# EAGLE design obcamera (EAGLE 9.6.2)
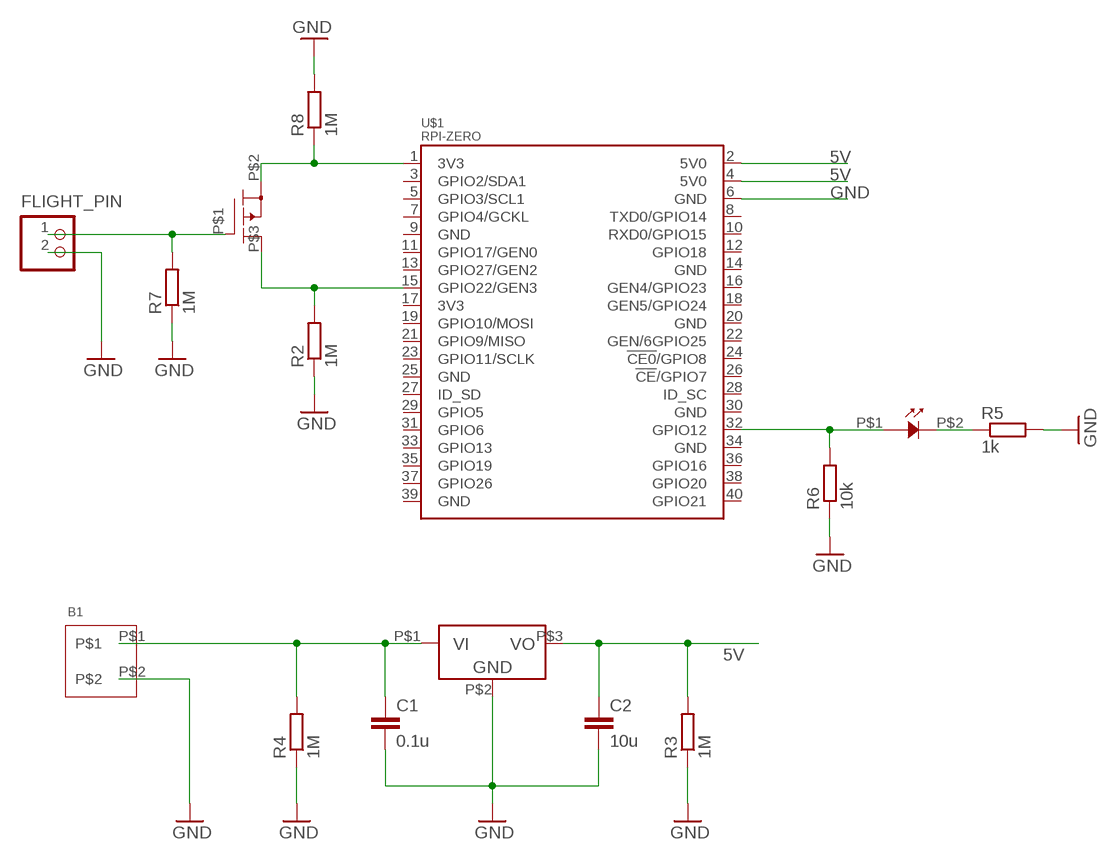
[diagram p0: schematic, sheet 1]

## Parts
B1  9V_BATTERY_HOLDER  [9V_BATTERY_HOLDER]
C1  0.1u  C-EUC2012  [C2012]
C2  10u  C-EUC2012  [C2012]
D1  SML-E1X  [SML-E1X]
FLIGHT_PIN  B2B-XH-A  [B2B-XH-A]
IC1  NJM2391  [TO252]
IC2  TJ8S06M3L  [TO252]
R2  1M  R-EU_M2012  [M2012]
R3  1M  R-EU_M2012  [M2012]
R4  1M  R-EU_M2012  [M2012]
R5  1k  R-EU_M2012  [M2012]
R6  10k  R-EU_M2012  [M2012]
R7  1M  R-EU_M2012  [M2012]
R8  1M  R-EU_M2012  [M2012]
U$1  RPI-ZERO  [RASP_PI_ZERO_BOARD_FULL]

## Nets
3V3@1: IC2.P$2 R8.1 U$1.1(3V3)
5V [supply]: C2.1 IC1.P$3 R3.2 U$1.2(5V0) U$1.4(5V0)
FLIGHT_IO: IC2.P$3 R2.2 U$1.15(GPIO22/GEN3)
GND [supply]: B1.P$2 C1.2 C2.2 FLIGHT_PIN.2 IC1.P$2 R2.1 R3.1 R4.1 R5.2 R6.1 R7.1 R8.2 U$1.6(GND)
N$1 [supply]: B1.P$1 C1.1 IC1.P$1 R4.2
N$3 [supply]: FLIGHT_PIN.1 IC2.P$1 R7.2
N$5: D1.P$2 R5.1
N$6: D1.P$1 R6.2 U$1.32(GPIO12)
Unconnected: U$1.3(GPIO2/SDA1) U$1.5(GPIO3/SCL1) U$1.7(GPIO4/GCKL) U$1.8(TXD0/GPIO14) U$1.9(GND) U$1.10(RXD0/GPIO15) U$1.11(GPIO17/GEN0) U$1.12(GPIO18) U$1.13(GPIO27/GEN2) U$1.14(GND) U$1.16(GEN4/GPIO23) U$1.17(3V3) U$1.18(GEN5/GPIO24) U$1.19(GPIO10/MOSI) U$1.20(GND) U$1.21(GPIO9/MISO) U$1.22(GEN/6GPIO25) U$1.23(GPIO11/SCLK) U$1.24(!CE0!/GPIO8) U$1.25(GND) U$1.26(!CE!/GPIO7) U$1.27(ID_SD) U$1.28(ID_SC) U$1.29(GPIO5) U$1.30(GND) U$1.31(GPIO6) U$1.33(GPIO13) U$1.34(GND) U$1.35(GPIO19) U$1.36(GPIO16) U$1.37(GPIO26) U$1.38(GPIO20) U$1.39(GND) U$1.40(GPIO21)

## Library data of the parts
B1 = 2022_nse:9V_BATTERY_HOLDER
C1 C2 = rcl:C-EU: CAPACITOR, European symbol; SPICEPREFIX: C
D1 = 2022_nse:SML-E1X
FLIGHT_PIN = jst-xh:B2B-XH-A: Wire-to-Board 2.5mm pitch top mount connector Source: http://www.jst-mfg.com/product/pdf/jpn/XH.pdf http://www.jst-mfg.com/product/detail.php?series=277
IC1 = 2022_nse:NJM2391
IC2 = 2022_nse:TJ8S06M3L
R2-R8 = rcl:R-EU_: RESISTOR, European symbol; SPICEPREFIX: R
U$1 = rpi-zero:RPI-ZERO

## Net classes
1 supply: width 1 mm, clearance 0.1 mm

## Board
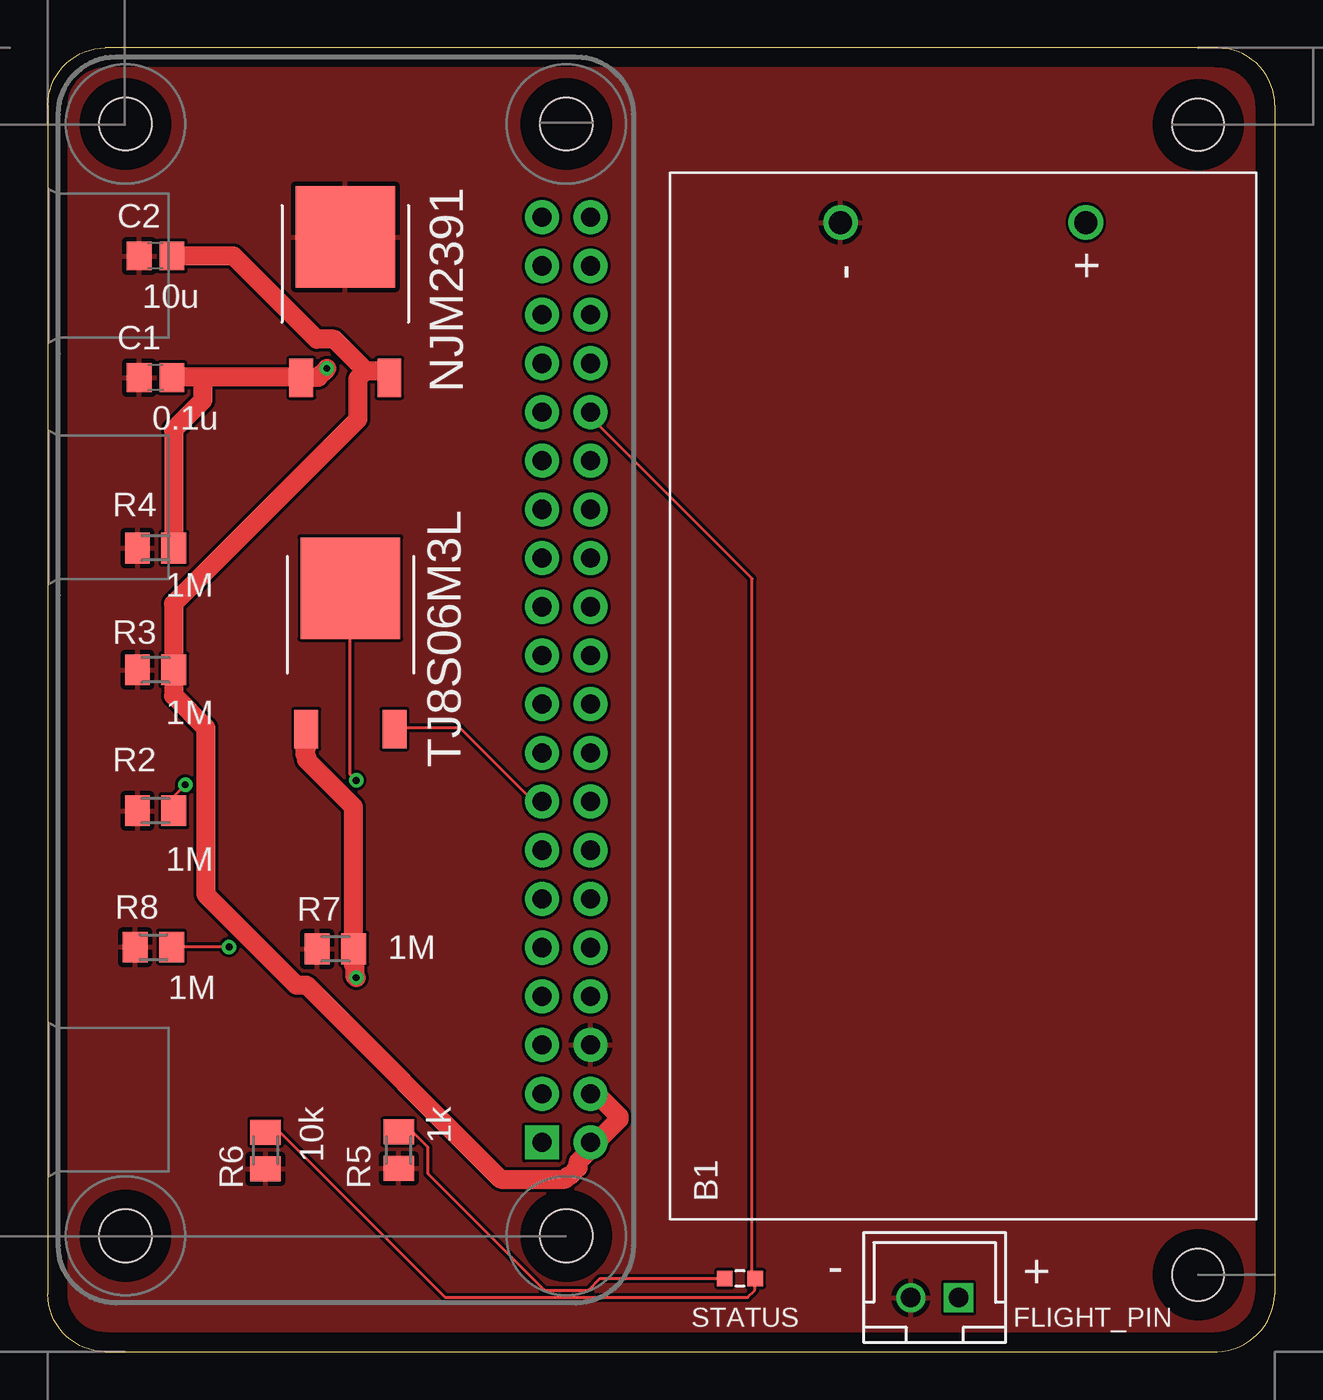
[diagram p1: board, top side]
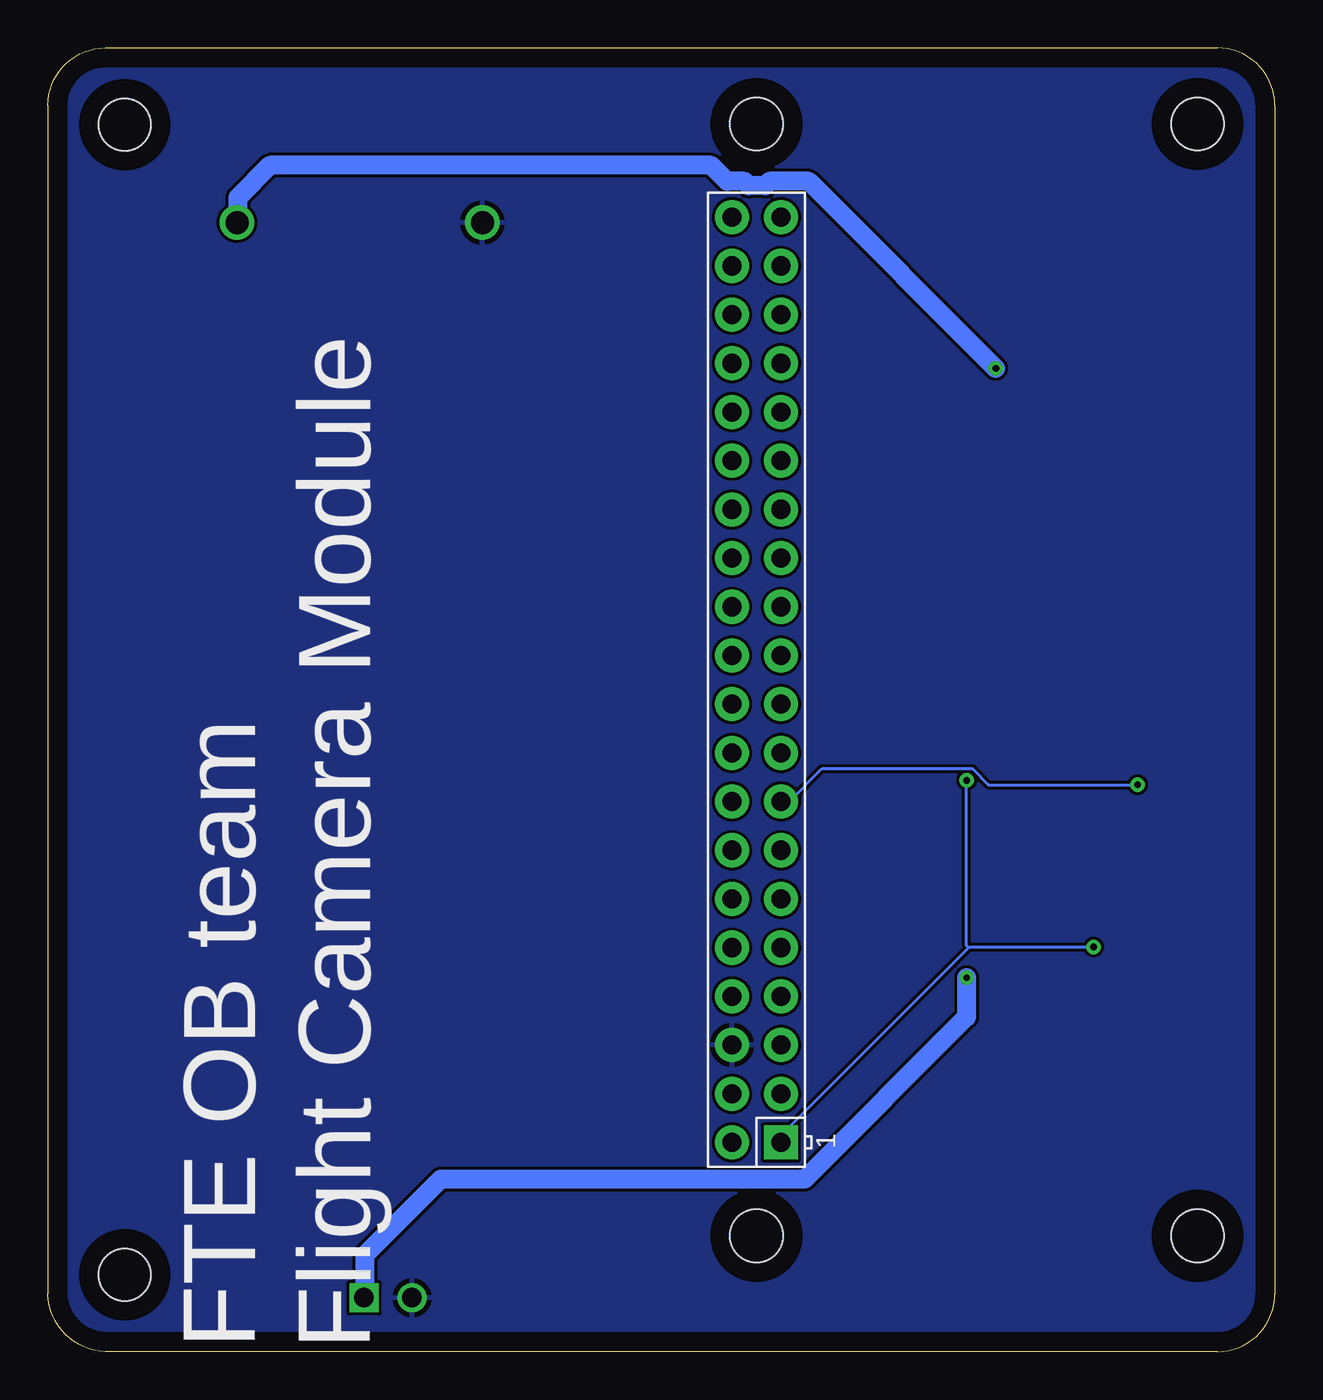
[diagram p2: board, bottom side, seen from below]

Size 64 x 68 mm. Coordinates in mm from the lower left corner, seen from the top.
Outline: 3,0 61,0 arc86 64,3 64,65 arc90 61,68 3,68 arc90 0,65 0,3 arc90 3,0
Copper layers (1*16): Top 0.035mm / dielectric 1.5mm / Bottom 0.035mm
Design rules "default": minimum track width 6mil, minimum drill 0.35mm, track to track 6mil, track to pad 6mil, pad to pad 6mil, via to via 6mil, smd to smd 6mil, copper to edge 40mil, drill to drill 6mil, minimum pad ring 10mil, minimum via ring 8mil, stop-mask expansion 4mil, vias tented up to drill 0mil, thermal gap 10mil
Holes 2.7 mm at 60,4 60,64

### Footprints (pad centres in the part's own frame; a part is rotated, then mirrored left to right if it is on the bottom)
9V_BATTERY_HOLDER = drill 1.2: P$1 52,8.9; P$2 52,21.7
C2012 = smd 1.3 x 1.5: 1 -0.85,0; 2 0.85,0
SML-E1X = smd 0.8 x 0.8: P$1 -0.8,0; P$2 0.8,0
B2B-XH-A = drill 1.016 square: 1 -1.25,0 | drill 1.016: 2 1.25,0
TO252 = smd 1.25 x 2: P$1 -2.3,-2.9; P$3 2.3,-2.9 | smd 5.2 x 5.3: P$2 0,4.45
M2012 = smd 1.3 x 1.6: 1 -0.95,0; 2 0.95,0
RASP_PI_ZERO_BOARD_FULL = drill 1 pad 1.778 square: 1 8.37,25.23 | drill 1 pad 1.778: 2 8.37,27.77; 3 10.91,25.23; 4 10.91,27.77; 5 13.45,25.23; 6 13.45,27.77; 7 15.99,25.23; 8 15.99,27.77; 9 18.53,25.23; 10 18.53,27.77; 11 21.07,25.23; 12 21.07,27.77; 13 23.61,25.23; 14 23.61,27.77; 15 26.15,25.23; 16 26.15,27.77; 17 28.69,25.23; 18 28.69,27.77; 19 31.23,25.23; 20 31.23,27.77; 21 33.77,25.23; 22 33.77,27.77; 23 36.31,25.23; 24 36.31,27.77; 25 38.85,25.23; 26 38.85,27.77; 27 41.39,25.23; 28 41.39,27.77; 29 43.93,25.23; 30 43.93,27.77; 31 46.47,25.23; 32 46.47,27.77; 33 49.01,25.23; 34 49.01,27.77; 35 51.55,25.23; 36 51.55,27.77; 37 54.09,25.23; 38 54.09,27.77; 39 56.63,25.23; 40 56.63,27.77 | hole 2.75: 3.5,3.5; 3.5,26.5; 61.5,3.5; 61.5,26.5

### Placement (x,y rotation side)
B1  63.04,6.89 90 top
C1  5.62,50.8 180 top
C2  5.62,57.15 180 top
D1  36.1,3.81 180 top
FLIGHT_PIN  46.26,2.81 180 top
IC1  15.51,53.69 0 top
IC2  15.78,35.37 0 top
R2  5.62,28.21 0 top
R3  5.62,35.56 0 top
R4  5.62,41.91 0 top
R5  18.3,10.51 270 top
R6  11.35,10.49 90 top
R7  15,21 0 top
R8  5.5,21.1 180 top
U$1  0.54,2.54 90 bottom

### Tracks (layer width: path | path; a pad name or v marks a point on that pad's centre or on a via)
3V3@1  (via drill 0.35)
  Top 0.152: v9.45,21.11 6.48,21.11 R8.1 | v16.08,29.79 15.77,30.1 15.77,39.78 IC2.P$2
  Bottom 0.152: v9.45,21.11 15.93,21.11 15.96,21.07 | 15.96,21.07 25.76,11.28 25.76,10.97 U$1.1 | v16.08,29.79 16.08,21.18 15.96,21.07
5V
  Top 1: U$1.4 28.35,13.41 28.65,13.41 29.79,12.27 29.79,12.12 28.65,10.97 28.35,10.97 U$1.2 28.19,10.44 27.66,9.91 27.66,9.6 27.2,9.14 27.13,9.14 26.98,8.99 23.62,8.99 13.49,19.13 12.95,19.13 8.23,23.85 8.23,32.54 6.55,34.21 6.55,34.98 6.63,35.05 R3.2 6.55,35.59 6.55,39.01 16.15,48.62 16.15,50.75 16.57,51.17 | C2.1 9.68,57.15 14.02,52.81 14.94,52.81 16.57,51.17 | 16.57,51.17 16.61,51.13 17.68,51.13 17.75,51.05 17.75,50.83 IC1.P$3
FLIGHT_IO  (via drill 0.35)
  Top 0.152: v7.16,29.57 6.63,29.03 6.63,28.27 R2.2 | IC2.P$3 18.14,32.54 21.49,32.54 25.3,28.73 25.76,28.73 U$1.15
  Bottom 0.152: v7.16,29.57 14.94,29.57 15.77,30.4 23.62,30.4 25.3,28.73 25.76,28.73 U$1.15
GND
  pour Top: 0,0 0,68 64,68 64,0
  pour Bottom: 0,0 0,68 64,68 64,0
N$1  (via drill 0.35)
  Top 1: 8.08,50.83 13.18,50.83 IC1.P$1 13.72,50.83 14.1,50.83 v14.55,51.28 | 8.08,50.83 6.48,50.83 C1.1 | 8.08,50.83 8.08,49.61 6.55,48.08 6.55,41.91 R4.2
  Bottom 1: v14.55,51.28 24.31,61.04 26.36,61.04 26.59,60.81 27.43,60.81 27.66,61.04 28.57,61.04 29.41,61.87 52.43,61.87 54.1,60.2 54.1,58.89 B1.P$1
N$3  (via drill 0.35)
  Top 1: IC2.P$1 13.49,31.47 13.41,31.39 13.41,31.17 13.49,31.09 13.49,30.86 15.93,28.42 15.93,21.03 R7.2 16,20.5 15.93,20.42 15.93,20.19 16,20.12 16,19.58 v16.08,19.51
  Bottom 1: v16.08,19.51 16.08,17.45 24.54,8.99 43.51,8.99 47.47,5.03 47.47,2.81 FLIGHT_PIN.1
N$5
  Top 0.152: D1.P$2 28.8,3.81 28.19,3.2 25.91,3.2 19.81,9.3 19.81,10.67 19.05,11.43 18.36,11.43 R5.1
N$6
  Top 0.152: 36.88,3.81 36.88,3.2 36.5,2.82 20.73,2.82 12.12,11.43 R6.2 | 36.88,3.81 36.73,3.96 36.73,40.31 28.35,48.69 28.35,49 U$1.32 | 36.88,3.81 D1.P$1

### Text on the board
tPlace: - | + | STATUS | FLIGHT_PIN
bPlace: Flight Camera Module | FTE OB team